# Altium schematic sheet SW6208+A+B+C+L+LED_普通188数码管.SchDoc
size A2
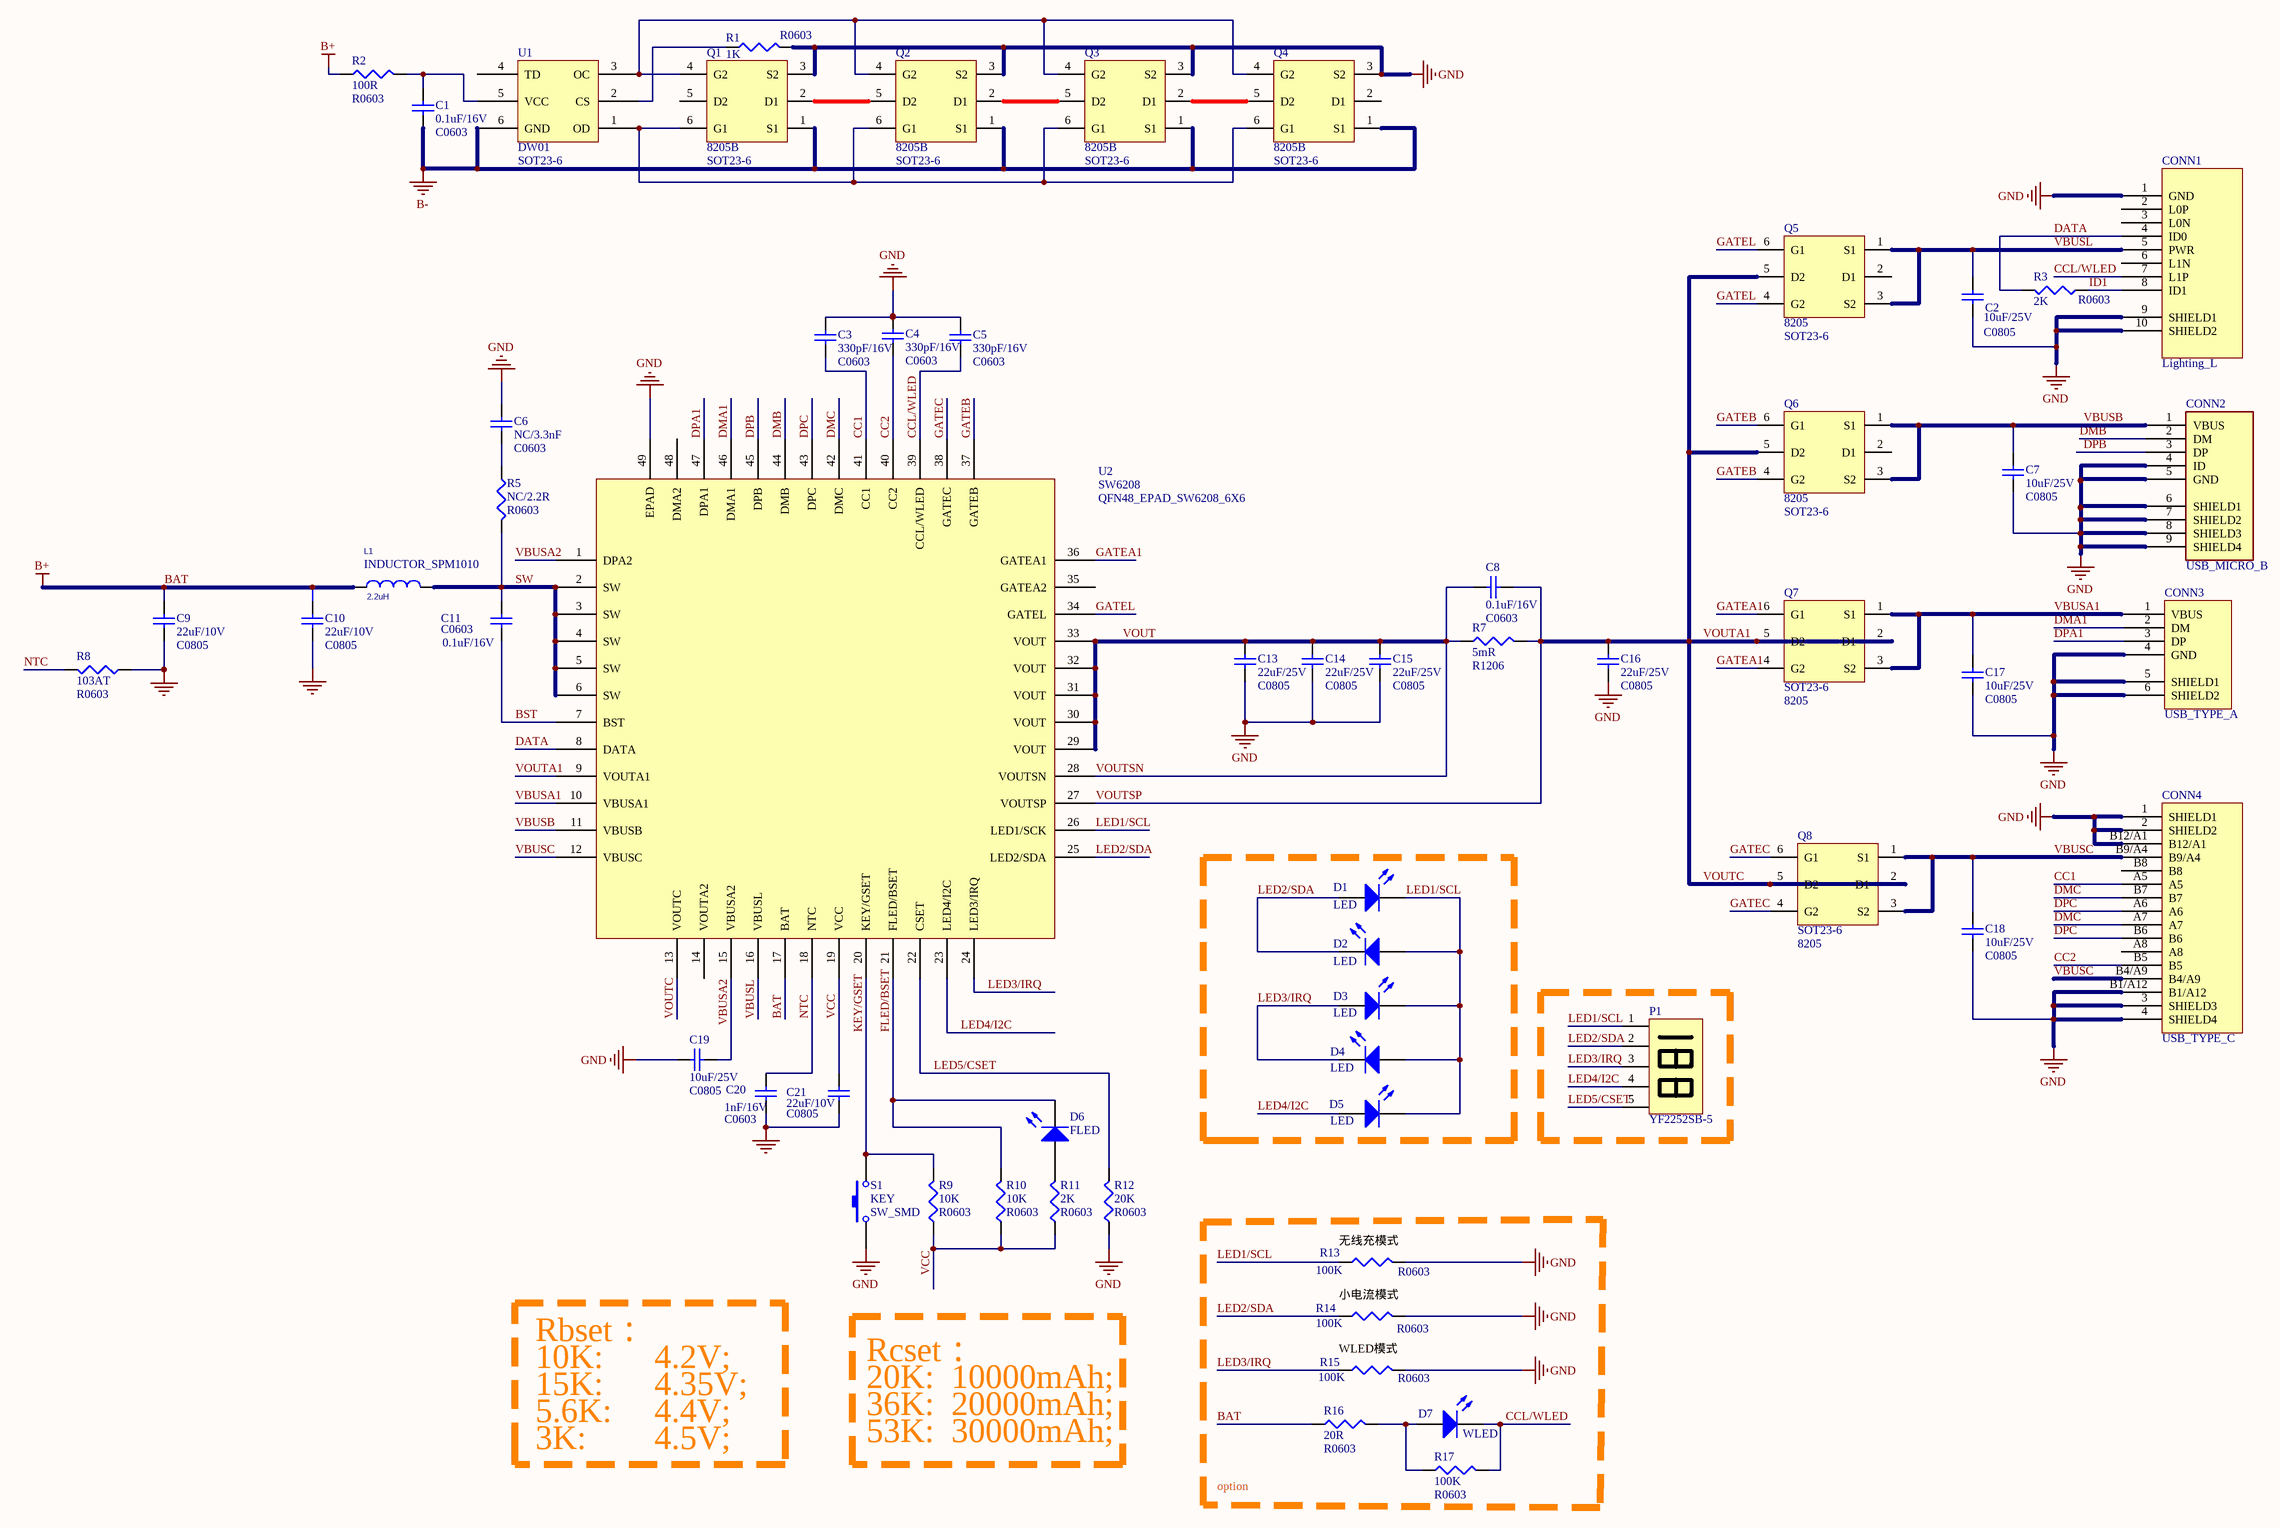
[diagram p0: SW6208+A+B+C+L+LED_普通188数码管.SchDoc]

## Parts
C1  0.1uF/16V  [C0603]
C2  10uF/25V  [C0805]
C3  330pF/16V  [C0603]
C4  330pF/16V  [C0603]
C5  330pF/16V  [C0603]
C6  NC/3.3nF  [C0603]
C7  10uF/25V  [C0805]
C8  0.1uF/16V  [C0603]
C9  22uF/10V  [C0805]
C10  22uF/10V  [C0805]
C11  0.1uF/16V  [C0603]
C13  22uF/25V  [C0805]
C14  22uF/25V  [C0805]
C15  22uF/25V  [C0805]
C16  22uF/25V  [C0805]
C17  10uF/25V  [C0805]
C18  10uF/25V  [C0805]
C19  10uF/25V  [C0805]
C20  1nF/16V  [C0603]
C21  22uF/10V  [C0805]
CONN1  Lighting_L  [Lighting]
CONN2  USB_MICRO_B  [USB_MICRO_B]
CONN3  USB_TYPE_A  [USB_TYPE_A]
CONN4  USB_TYPE_C  [USB_TYPE_C]
D1  LED  [LED0603]
D2  LED  [LED0603]
D3  LED  [LED0603]
D4  LED  [LED0603]
D5  LED  [LED0603]
D6  FLED  [LED0603]
D7  WLED  [LED_5MM]
L1  2.2uH  [INDUCTOR_SPM1010]
P1  YF2252SB-5  [LED_Display_5]
Q1  8205B  [SOT23-6]
Q2  8205B  [SOT23-6]
Q3  8205B  [SOT23-6]
Q4  8205B  [SOT23-6]
Q5  8205  [SOT23-6]
Q6  8205  [SOT23-6]
Q7  Footprinf: SOT23-6  [SOT-23-6]  (hidden comment: 8205)
Q8  Footprinf: SOT23-6  [SOT-23-6]  (hidden comment: 8205)
R1  1K  [R0603]
R2  100R  [R0603]
R3  2K  [R0603]
R5  NC/2.2R  [R0603]
R7  5mR  [R1206]
R8  103AT  [R0603]
R9  10K  [R0603]
R10  10K  [R0603]
R11  2K  [R0603]
R12  20K  [R0603]
R13  100K  [R0603]
R14  100K  [R0603]
R15  100K  [R0603]
R16  20R  [R0603]
R17  100K  [R0603]
S1  KEY  [SW_SMD]
U1  DW01  [SOT23-6]
U2  SW6208  Footprint: QFN48_EPAD_SW6208_6X6  [QFN48_6X6_EPAD]

## Nets
B-: C1.1 Q1.1(S1) Q2.1(S1) Q3.1(S1) Q4.1(S1) U1.6(GND)
BAT: C9.2 C10.2 L1.1 R2.1 R16.1 U2.17(BAT)  [also labelled B+]
GND: C2.1 C3.2 C4.2 C5.2 C6.2 C7.1 C9.1 C10.1 C13.1 C14.1 C15.1 C16.1 C17.1 C18.1 C19.1 C20.2 C21.2 CONN1.1(GND) CONN1.9(SHIELD1) CONN1.10(SHIELD2) CONN2.4(ID) CONN2.5(GND) CONN2.6(SHIELD1) CONN2.7(SHIELD2) CONN2.8(SHIELD3) CONN2.9(SHIELD4) CONN3.4(GND) CONN3.5(SHIELD1) CONN3.6(SHIELD2) CONN4.1(SHIELD1) CONN4.2(SHIELD2) CONN4.3(SHIELD3) CONN4.4(SHIELD4) CONN4.B1/A12 CONN4.B12/A1 Q1.3(S2) Q2.3(S2) Q3.3(S2) Q4.3(S2) R1.2 R8.1 R12.1 R13.2 R14.2 R15.2 S1.1 U2.49(EPAD)
BST: C11.1 U2.7(BST)
CC1: C3.1 CONN4.A5 U2.41(CC1)
CC2: C4.1 CONN4.B5 U2.40(CC2)
CCL/WLED: C5.1 CONN1.7(L1P) D7.2(K) R17.2 U2.39(CCL/WLED)
DATA: CONN1.4(ID0) R3.2 U2.8(DATA)
DMA1: CONN3.2(DM) U2.46(DMA1)
DMB: CONN2.2(DM) U2.44(DMB)
DMC: CONN4.A7 CONN4.B7 U2.42(DMC)
DPA1: CONN3.3(DP) U2.47(DPA1)
DPB: CONN2.3(DP) U2.45(DPB)
DPC: CONN4.A6 CONN4.B6 U2.43(DPC)
FLED/BSET: D6.2(K) R10.2 U2.21(FLED/BSET)
GATEA1: Q7.4(G2) Q7.6(G1) U2.36(GATEA1)
GATEB: Q6.4(G2) Q6.6(G1) U2.37(GATEB)
GATEC: Q8.4(G2) Q8.6(G1) U2.38(GATEC)
GATEL: Q5.4(G2) Q5.6(G1) U2.34(GATEL)
ID1: CONN1.8(ID1) R3.1
KEY/GSET: R9.2 S1.2 U2.20(KEY/GSET)
LED1/SCL: D1.2(K) D2.1(A) D3.2(K) D4.1(A) D5.2(K) P1.1(F) R13.1 U2.26(LED1/SCK)
LED2/SDA: D1.1(A) D2.2(K) P1.2(C) R14.1 U2.25(LED2/SDA)
LED3/IRQ: D3.1(A) D4.2(K) P1.3(D) R15.1 U2.24(LED3/IRQ)
LED4/I2C: D5.1(A) P1.4(E) U2.23(LED4/I2C)
LED5/CSET: P1.5(G) R12.2 U2.22(CSET)
NTC: C20.1 R8.2 U2.18(NTC)
SW: C11.2 L1.2 R5.2 U2.2(SW) U2.3(SW) U2.4(SW) U2.5(SW) U2.6(SW)
VBUSA1: C17.2 Q7.1(S1) Q7.3(S2) U2.10(VBUSA1)
VBUSA2: C19.2 U2.1(DPA2) U2.15(VBUSA2)
VBUSB: C7.2 CONN2.1(VBUS) Q6.1(S1) Q6.3(S2) U2.11(VBUSB)
VBUSC: C18.2 CONN4.B4/A9 CONN4.B9/A4 Q8.1(S1) Q8.3(S2) U2.12(VBUSC)
VBUSL: C2.2 CONN1.5(PWR) Q5.1(S1) Q5.3(S2) U2.16(VBUSL)
VCC: C21.1 R9.1 R10.1 R11.1 U2.19(VCC)
VOUT: C8.1 C13.2 C14.2 C15.2 R7.1 U2.28(VOUTSN) U2.29(VOUT) U2.30(VOUT) U2.31(VOUT) U2.32(VOUT) U2.33(VOUT)  [also labelled VOUTSN]
VOUTA1: C8.2 C16.2 Q5.5(D2) Q6.5(D2) Q7.2(D1) Q7.5(D2) Q8.2(D1) Q8.5(D2) R7.2 U2.9(VOUTA1) U2.13(VOUTC) U2.27(VOUTSP)  [also labelled VOUTC, VOUTSP]
NetC1_2: C1.2 R2.2 U1.5(VCC)
NetC6_1: C6.1 R5.1
NetD6_1: D6.1(A) R11.2
NetD7_1: D7.1(A) R16.2 R17.1
NetQ1_2: Q1.2(D1) Q2.5(D2)
NetQ1_4: Q1.4(G2) Q2.4(G2) Q3.4(G2) Q4.4(G2) U1.3(OC)
NetQ1_6: Q1.6(G1) Q2.6(G1) Q3.6(G1) Q4.6(G1) U1.1(OD)
NetQ2_2: Q2.2(D1) Q3.5(D2)
NetQ3_2: Q3.2(D1) Q4.5(D2)
NetR1_1: R1.1 U1.2(CS)

Not connected (* = marked no-connect by the designer): CONN1 2(L0P) 3(L0N) 6(L1N); CONN3 1(VBUS); CONN4 A8 B8; Q1 5(D2); Q4 2(D1); Q5 2(D1); Q6 2(D1); U1 4(TD); U2 14(VOUTA2) 35(GATEA2) 48(DMA2)

## Notes on the sheet
- (near R13) 无线充模式
- (near R14) 小电流模式
- Rbset：
- 10K:      4.2V;
- Rcset：
- 20K:  10000mAh;
- (near R15) WLED模式
- 15K:      4.35V;
- 5.6K:     4.4V;
- 3K:        4.5V;
- 36K:  20000mAh;
- 53K:  30000mAh;
- option

## Library data of the parts
C1 C3-C6 C8 C11 C20 = CAP0603: Capacitor; Value: 22uF/16V; Published: 8-Jun-2000; LatestRevisionDate: 17-Jul-2002; LatestRevisionNote: Re-released for DXP Platform.; PackageReference: RAD-0.3; Publisher: Altium Limited; PackageDescription: Radial Cap, Thru-Hole; 2 Leads; 0.3 in Pin Spacing
C2 C7 C9 C10 C17-C19 C21 = CAP0805: Capacitor; Value: 22uF/25V; Published: 8-Jun-2000; LatestRevisionDate: 17-Jul-2002; LatestRevisionNote: Re-released for DXP Platform.; PackageReference: RAD-0.3; Publisher: Altium Limited; PackageDescription: Radial Cap, Thru-Hole; 2 Leads; 0.3 in Pin Spacing
C13-C16 = CAP0805: Capacitor; Published: 8-Jun-2000; LatestRevisionDate: 17-Jul-2002; LatestRevisionNote: Re-released for DXP Platform.; PackageReference: RAD-0.3; Publisher: Altium Limited; PackageDescription: Radial Cap, Thru-Hole; 2 Leads; 0.3 in Pin Spacing; Value: 22uF/25V
CONN1 = LIGHTING_PORT: Value: Lighting_L; Footprint: Lighting_L
D1-D5 = LED_0603: Value: FLED; Published: 8-Jun-2000; LatestRevisionDate: 08-Jul-2005; LatestRevisionNote: Mech Layer 1 removed.; PackageReference: LED-0; Publisher: Altium Limited; PackageDescription: LED; 2 Leads
D6 = LED_0603: LED; Published: 8-Jun-2000; LatestRevisionDate: 08-Jul-2005; LatestRevisionNote: Mech Layer 1 removed.; PackageReference: LED-0; Publisher: Altium Limited; PackageDescription: LED; 2 Leads; Value: FLED
D7 = WLED: Value: FLED; Published: 8-Jun-2000; LatestRevisionDate: 08-Jul-2005; LatestRevisionNote: Mech Layer 1 removed.; PackageReference: LED-0; Publisher: Altium Limited; PackageDescription: LED; 2 Leads
L1 = INDUCTOR_SPM1010: INDUCTOR; Value: 2.2uH
P1 = LED_Display_5: 188_LED_Display
Q1-Q4 = 8205: NMOS; Value: 8205; Footprinf: SOT23-6
Q5 Q6 = 8205: NMOS; Value: 8205; Footprinf: SOT23-6
Q7 Q8 = 8205B: Value: 8205
R1-R3 R5 R8 R11-R17 = RES_0603: Resistor; Value: 10K; Published: 8-Jun-2000; LatestRevisionDate: 29-May-2009; LatestRevisionNote: IPC-7351 Footprint Added.; PackageReference: J1-0603; Publisher: Altium Limited; PackageDescription: Chip Resistor
R7 = RES_1206: Resistor; Value: 10K; Published: 8-Jun-2000; LatestRevisionDate: 29-May-2009; LatestRevisionNote: IPC-7351 Footprint Added.; PackageReference: J1-0603; Publisher: Altium Limited; PackageDescription: Chip Resistor
R9 R10 = RES_0603: Resistor; Published: 8-Jun-2000; LatestRevisionDate: 29-May-2009; LatestRevisionNote: IPC-7351 Footprint Added.; PackageReference: J1-0603; Publisher: Altium Limited; PackageDescription: Chip Resistor; Value: 10K
S1 = SW K: Value: KEY; Footprinf: SW_SMD
U1 = DW01: BAT_PROTECT_IC; Value: DW01
U2 = SW6208: IC
CONN2 = USB_MICRO_B: Footprintf: MICRO_B; Value: USB_MICRO_B
CONN4 = USB_TYPE_C: Value: USB_TYPE_C